# EAGLE design Qwiic Multi Distance Sensor - VL53L3CX (EAGLE 9.5.2)
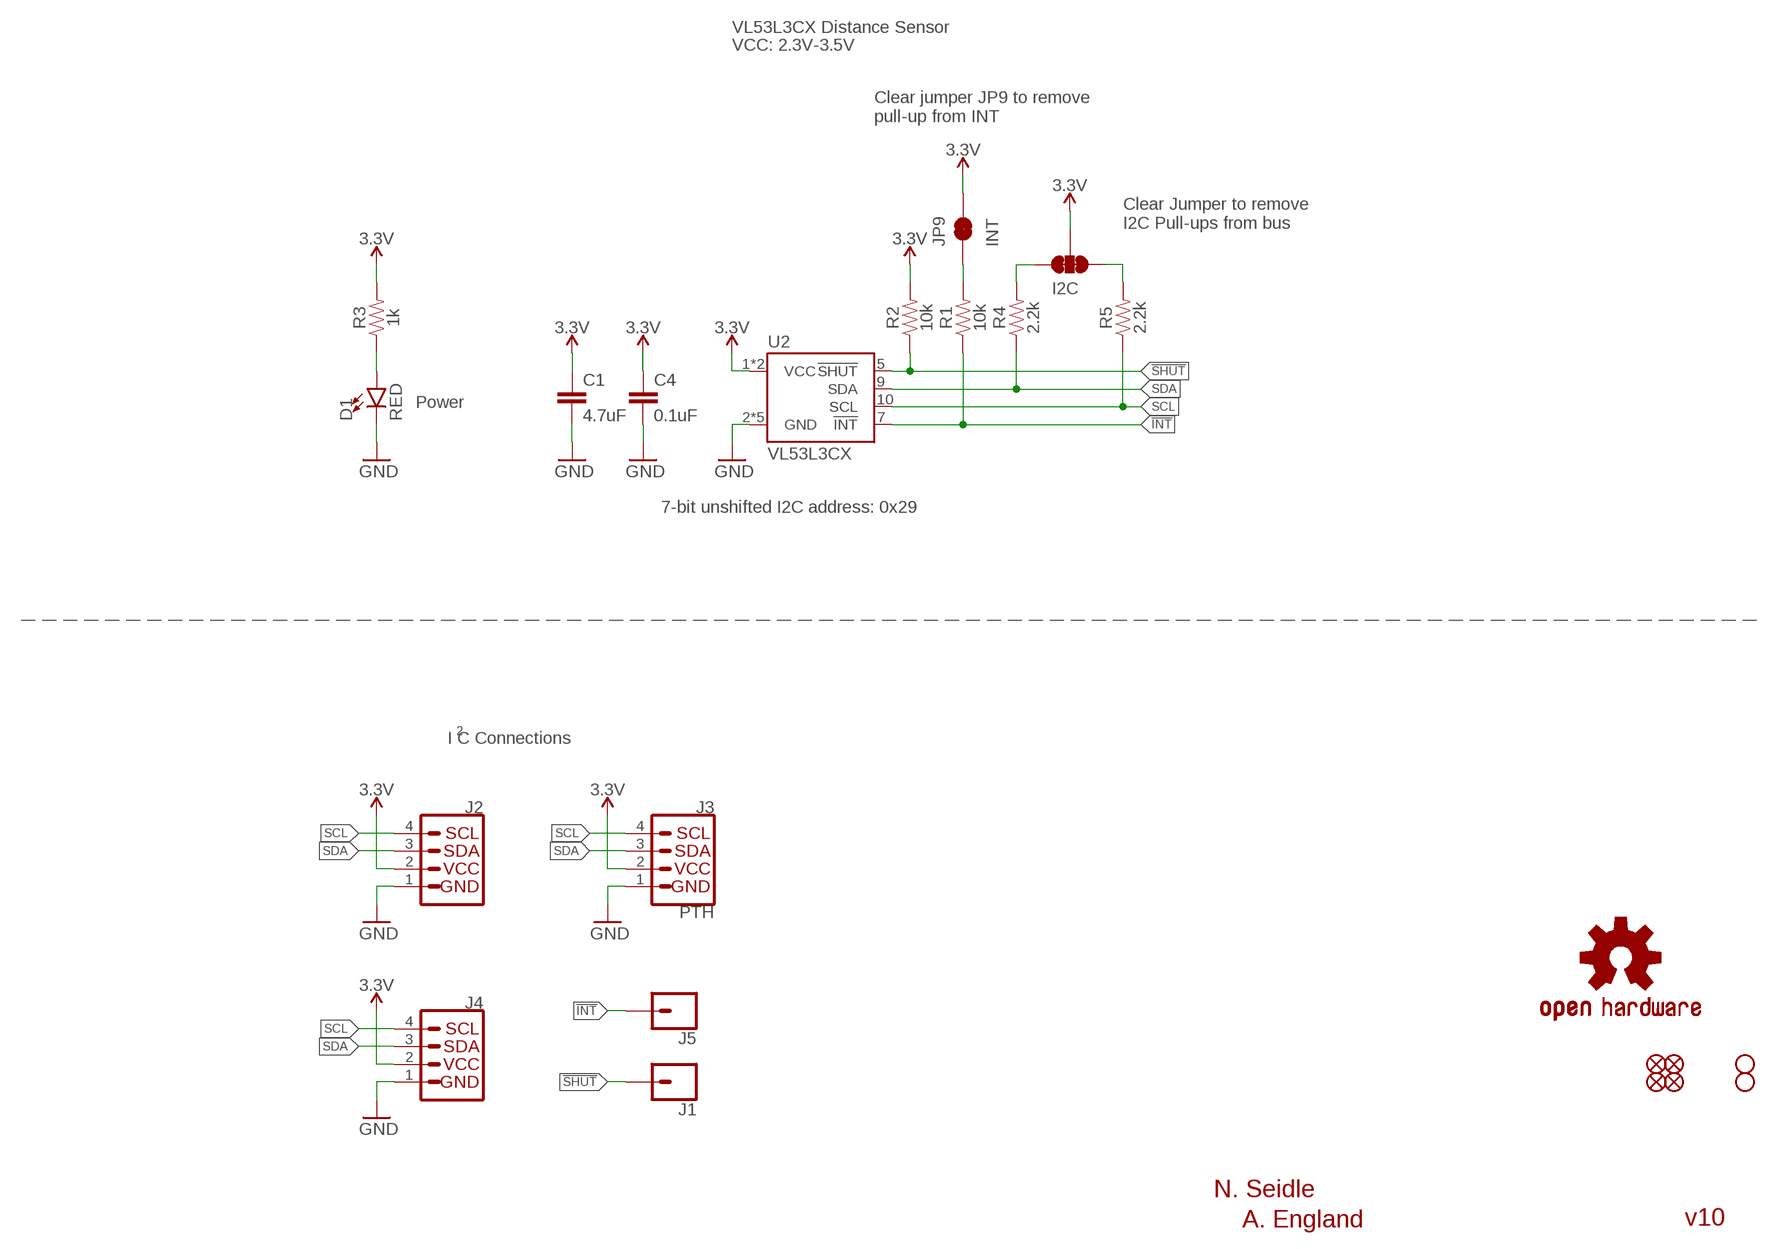
[diagram p0: schematic, sheet 1]

## Parts
C1  4.7uF  4.7UF0603  [0603]
C4  0.1uF  0.1UF-0603-25V-(+80/-20%)  [0603]
D1  RED  LED-RED0603  [LED-0603]
I2C  JUMPER-SMT_3_2-NC_TRACE_SILK  [SMT-JUMPER_3_2-NC_TRACE_SILK]
J1  CONN_01PTH_NO_SILK_YES_STOP  [1X01_NO_SILK]
J2  QWIIC_CONNECTORJS-1MM  [1X04_1MM_RA]
J3  PTH  I2C_STANDARD_NO_SILK  [1X04_NO_SILK]
J4  QWIIC_CONNECTORJS-1MM  [1X04_1MM_RA]
J5  CONN_01PTH_NO_SILK_YES_STOP  [1X01_NO_SILK]
JP1  FIDUCIALUFIDUCIAL  [MICRO-FIDUCIAL]
JP2  FIDUCIALUFIDUCIAL  [MICRO-FIDUCIAL]
JP3  STAND-OFF  [STAND-OFF]
JP4  STAND-OFF  [STAND-OFF]
JP5  FIDUCIALUFIDUCIAL  [MICRO-FIDUCIAL]
JP6  FIDUCIALUFIDUCIAL  [MICRO-FIDUCIAL]
JP9  INT  JUMPER-PAD-2-NC_BY_TRACE  [PAD-JUMPER-2-NC_BY_TRACE_YES_SILK]
LOGO1  OSHW-LOGOMINI  [OSHW-LOGO-MINI]
R1  10k  10KOHM-0603-1/10W-1%  [0603]
R2  10k  10KOHM-0603-1/10W-1%  [0603]
R3  1k  1KOHM-0603-1/10W-1%  [0603]
R4  2.2k  2.2KOHM-0603-1/10W-1%  [0603]
R5  2.2k  2.2KOHM-0603-1/10W-1%  [0603]
U2  VL53L3CX  VL53L1XSMD  [VL53L1X]

## Nets
3.3V: C1.1 C4.1 I2C.2 J2.2 J3.2(VCC) J4.2 JP9.2 R2.2 R3.2 U2.1(VCC) U2.11(VCC)
!INT: J5.1 R1.1 U2.7(!INT)
!SHUT: J1.1 R2.1 U2.5(!SHUT)
GND: C1.2 C4.2 D1.C J2.1 J3.1(GND) J4.1 U2.2(GND) U2.3(GND) U2.4(GND) U2.6(GND) U2.12(GND)
N$1: I2C.1 R5.2
N$2: I2C.3 R4.2
N$3: D1.A R3.1
N$4: JP9.1 R1.2
SCL: J2.4 J3.4(SCL) J4.4 R5.1 U2.10(SCL)
SDA: J2.3 J3.3(SDA) J4.3 R4.1 U2.9(SDA)

## Notes on the sheet
- VL53L3CX Distance Sensor
- VCC: 2.3V-3.5V
- Clear jumper JP9 to remove 
  pull-up from INT
- Clear Jumper to remove 
  I2C Pull-ups from bus
- Power
- 7-bit unshifted I2C address: 0x29
- 2
- I C Connections
- N. Seidle
- A. England | v10

## Library data of the parts
C1 = SparkFun-Capacitors:4.7UF: 4.7µF ceramic capacitors A capacitor is a passive two-terminal electrical component used to store electrical energy temporarily in an electric field.; PROD_ID: CAP-08280
C4 = SparkFun-Capacitors:0.1UF: 0.1µF ceramic capacitors A capacitor is a passive two-terminal electrical component used to store electrical energy temporarily in an electric field.; PROD_ID: CAP-00810
D1 = SparkFun-LED:LED-RED: Red SMD LED Used in manufacturing of most products at SparkFun Packages: 0603 - SMD 0603 package [Product Link] <http://docs.avagotech.com/docs/AV02-0551EN> 0603 SMART - SMD 0603 SMART package ( more efficient and expensive)[Product Link] <http://www.osram-os.com/Graphics/XPic2/00077099_0.pdf> 1206 - SMD1206 package [Product Link] <https://www.sparkfun.com/datasheets/DevTools/LilyPad/Q150OVS4.pdff> SparkFun Products: Pro Mini 328 -5V <https://www.sparkfun.com/products/821> RedBoard <https://www.sparkfun.com/products/12757> IOIO-OTG <https://www.sparkfun.com/products/13613>; PROD_ID: DIO-00819
I2C = SparkFun-Jumpers:JUMPER-SMT_3_2-NC_TRACE: Normally closed trace jumper (2 of 2 connections) This jumper has a trace between all three pads so they are normally closed (NC). Use a razor knife to open the connection(s). For best results follow the IPC guidelines for cutting traces: Cutout at least 0.063 mm (0.005 in). Remove all loose material to clean up the cut area. Seal the cut with an approved epoxy. Reapply solder to reclose the connection(s).
J1 J5 = SparkFun-Connectors:CONN_01: Single connection point. Often used as Generic Header-pin footprint for 0.1 inch spaced/style header connections On any of the 0.1 inch spaced packages, you can populate with these: Break Away Headers - Straight <https://www.sparkfun.com/products/116> (PRT-00116) Break Away Male Headers - Right Angle <https://www.sparkfun.com/products/553> (PRT-00553) Female Headers <https://www.sparkfun.com/products/115> (PRT-00115) Break Away Headers - Machine Pin <https://www.sparkfun.com/products/117> (PRT-00117) Break Away Female Headers - Swiss Machine Pin <https://www.sparkfun.com/products/743> (PRT-00743) This device is also useful as a general connection point to wire up your design to another part of your project. Our various solder wires solder well into these plated through hole pads. Hook-Up Wire - Assortment (Stranded, 22 AWG) <https://www.sparkfun.com/products/11375> (PRT-11375) Hook-Up Wire - Assortment (Solid Core, 22 AWG) <https://www.sparkfun.com/products/11367> (PRT-11367) View the entire wire category on our website here <https://www.sparkfun.com/categories/141> Special notes: SMTSO-256-ET is a "flush mount" nut for a 4-40 screw. We mostly use this on specialty testbeds; it is a nice way to connect hardware to your PCB at an adjustable hieght. Also note, the SNAP packages are for using a snappable style connector. We sell a baggie of snaps and they are also used on two LilyPad designs: Snap Assortment - 30 pack (male and female) <https://www.sparkfun.com/products/11347> (DEV-11347) LilyPad Arduino SimpleSnap <https://www.sparkfun.com/products/10941> (DEV-10941) LilyPad SimpleSnap Protoboard <https://www.sparkfun.com/products/10940> (DEV-10940)
J2 J4 = SparkFun-Connectors:QWIIC_CONNECTOR: SparkFun I2C Standard Qwiic Connector An SMD 1mm pitch JST connector makes it easy and quick (get it? Qwiic?) to connect I2C devices to each other. The Qwiic system <http://www.sparkfun.com/qwiic> enables fast and solderless connection between popular platforms and various sensors and actuators. We carry 200mm <https://www.sparkfun.com/products/14204>, 100mm <https://www.sparkfun.com/products/14205>, 50mm <https://www.sparkfun.com/products/14206>, and breadboard friendly <https://www.sparkfun.com/products/14207> Qwiic cables. We also offer 10 pcs strips <https://www.sparkfun.com/products/14323> the SMD connectors.; PROD_ID: CONN-13694
J3 = SparkX:I2C_STANDARD: SparkFun I2C Standard Pinout Header SparkFun has standardized on a pinout for all I2C based sensor breakouts. This pinout allows I2C boards to be plugged directly into the headers on Arduino Uno compatible boards, and to be daisy chained easily. Example SparkFun Products: SparkFun Atmospheric Sensor Breakout - BME280 <https://www.sparkfun.com/products/13676> SparkFun Altitude/Pressure Sensor Breakout - MPL3115A2 <https://www.sparkfun.com/products/11084> SparkFun TOF Range Finder Sensor - VL6180 <https://www.sparkfun.com/products/12785>
JP1 JP2 JP5 JP6 = SparkFun:FIDUCIAL: Fiducial Alignment Points Various fiducial points for machine vision alignment.
JP3 JP4 = SparkFun:STAND-OFF: Stand Off This is the mechanical footprint for a #4 phillips button head screw. Use the keepout ring to avoid running the screw head into surrounding components. SKU : PRT-00447
JP9 = SparkFun-Passives:JUMPER-PAD-2-NC_BY_TRACE
LOGO1 = SparkFun-Aesthetics:OSHW-LOGO: Open-Source Hardware (OSHW) Logo This logo indicates the piece of hardware it is found on incorporates a OSHW license and/or adheres to the definition of open source hardware found here: http://freedomdefined.org/OSHW
R1 R2 = SparkFun-Resistors:10KOHM: 10kΩ resistor A resistor is a passive two-terminal electrical component that implements electrical resistance as a circuit element. Resistors act to reduce current flow, and, at the same time, act to lower voltage levels within circuits. - Wikipedia; PROD_ID: RES-00824
R3 = SparkFun-Resistors:1KOHM: 1kΩ resistor A resistor is a passive two-terminal electrical component that implements electrical resistance as a circuit element. Resistors act to reduce current flow, and, at the same time, act to lower voltage levels within circuits. - Wikipedia; PROD_ID: RES-07856
R4 R5 = SparkFun-Resistors:2.2KOHM: 2.2kΩ resistor A resistor is a passive two-terminal electrical component that implements electrical resistance as a circuit element. Resistors act to reduce current flow, and, at the same time, act to lower voltage levels within circuits. - Wikipedia; PROD_ID: RES-08272
U2 = SparkFun-Sensors:VL53L1X: STMicroelectronics VL53L1X - 400 cm IR Laser ToF Sensor VL53L1X is a state-of-the-art ToF laser-ranging sensor, enhancing the ST FlightSense product family. It is the fastest miniature ToF sensor currently on the market with accurate ranging up to 4 m and fast ranging frequency (up to 50 Hz). Housed in a miniature and reflowable package, it integrates a single photon avalanche diode (SPAD) receiving array, a 940 nm invisible laser Class 1 emitter, physical infrared filters, and optics to achieve the best ranging performance in various ambient lighting conditions with a range of cover window options.; PROD_ID: IC-13960

## Net classes
1 power: width 0.203 mm

## Board
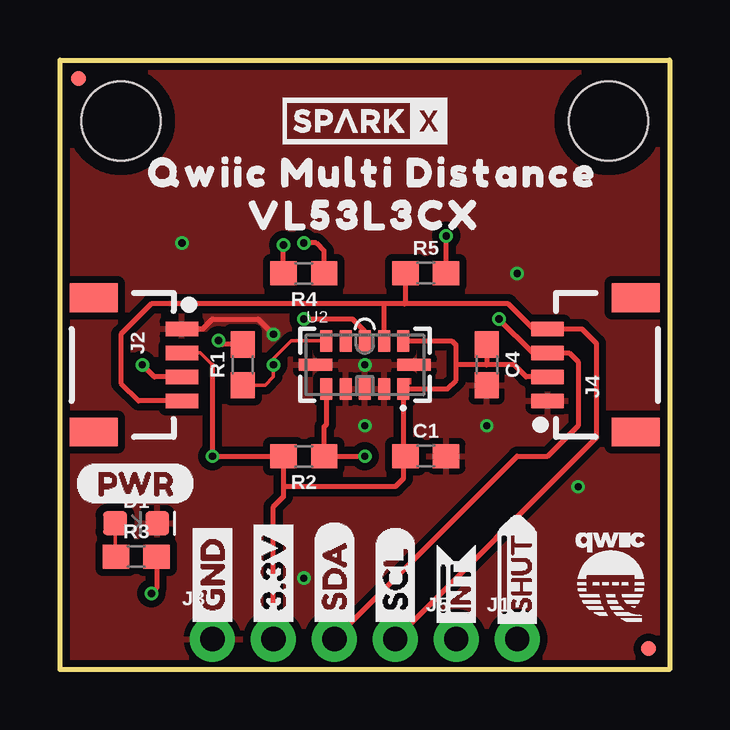
[diagram p1: board, top side]
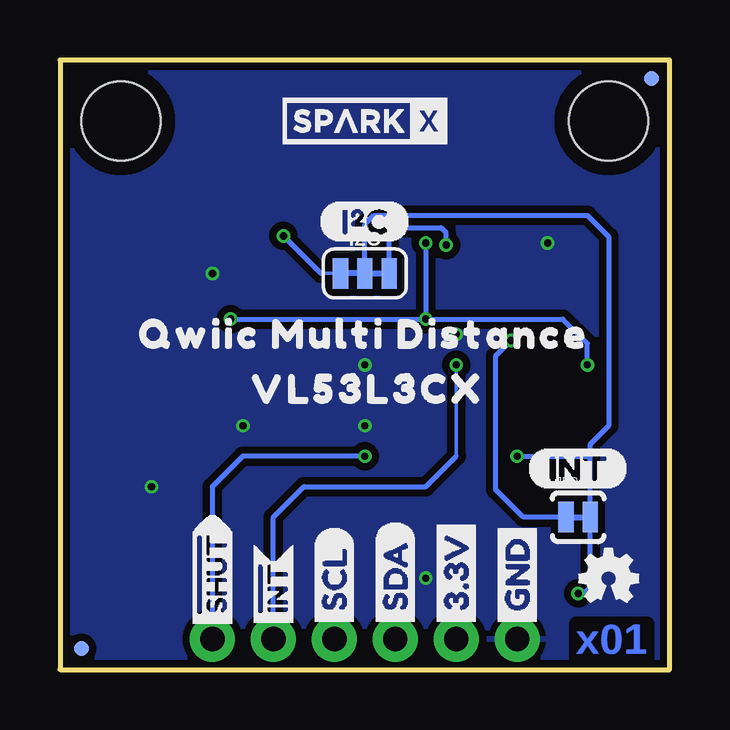
[diagram p2: board, bottom side, seen from below]

Size 25.4 x 25.4 mm. Coordinates in mm from the lower left corner, seen from the top.
Outline: 0,0 0,25.4 25.4,25.4 25.4,0 0,0
Copper layers (1*16): Top 0.035mm / dielectric 1.5mm / Bottom 0.035mm
Design rules "SparkFun-2-layer-FAB-LIMIT": minimum track width 4mil, minimum drill 6mil, track to track 4mil, track to pad 4mil, pad to pad 4mil, via to via 4mil, smd to smd 4mil, copper to edge 4mil, drill to drill 4mil, minimum pad ring 5mil, minimum via ring 5mil, stop-mask expansion 4mil, vias tented up to drill 25mil, thermal gap 10mil

### Footprints (pad centres in the part's own frame; a part is rotated, then mirrored left to right if it is on the bottom)
0603 = smd 1.1 x 1: 1 -0.85,0; 2 0.85,0
LED-0603 = smd 1 x 1: A -0.877,0; C 0.877,0
SMT-JUMPER_3_2-NC_TRACE_SILK = smd 0.635 x 1.27: 1 -1.016,0; 2 0,0; 3 1.016,0
1X01_NO_SILK = drill 1.016 pad 1.88: 1 0,0
1X04_1MM_RA = smd 0.6 x 1.35: 1 -1.5,0; 2 -0.5,0; 3 0.5,0; 4 1.5,0 | smd 1.2 x 2: NC1 2.8,-3.675; NC2 -2.8,-3.675
1X04_NO_SILK = drill 1.016 pad 1.88: 1 0,0; 2 2.54,0; 3 5.08,0; 4 7.62,0
MICRO-FIDUCIAL = smd 0.635 x 0.635: 1 0,0
STAND-OFF = hole 3.302: 0,0
PAD-JUMPER-2-NC_BY_TRACE_YES_SILK = smd 0.635 x 1.27: 1 -0.508,0; 2 0.508,0
VL53L1X = smd 0.5 x 0.9: 1 1.6,-1; 2 0.8,-1; 3 0,-1; 4 -0.8,-1; 5 -1.6,-1; 7 -1.6,1; 8 -0.8,1; 9 0,1; 10 0.8,1; 11 1.6,1 | smd 1.4 x 0.5: 6 -2.05,0; 12 2.05,0

### Placement (x,y rotation side)
C1  15.24,8.89 0 top
C4  17.78,12.7 270 top
D1  3.17,6.1 0 top
I2C  12.7,16.51 0 bottom
J1  19.05,1.27 0 top
J2  5.08,12.7 270 top
J3  6.35,1.27 0 top
J4  20.32,12.7 90 top
J5  16.51,1.27 0 top
JP1  0.76,24.64 0 bottom
JP2  24.51,0.89 0 top
JP3  2.54,22.86 0 top
JP4  22.86,22.86 0 top
JP5  24.51,0.89 0 bottom
JP6  0.76,24.64 0 top
JP9  3.81,6.35 0 bottom
LOGO1  2.54,3.81 0 bottom
R1  7.62,12.7 90 top
R2  10.16,8.89 180 top
R3  3.17,4.7 0 top
R4  10.16,16.51 180 top
R5  15.24,16.51 0 top
U2  12.7,12.7 0 top
U$1  [VL53L3CX0]  6.99,18.92 0 top
U$2  [QWIIC_MULTI_DISTANCE1]  2.79,20.7 0 top
U$3  [GND1]  6.35,1.52 90 bottom
U$4  [3#3V2]  8.89,1.52 90 bottom
U$5  [SDA8]  11.43,1.52 90 bottom
U$6  [SCL9]  13.97,1.52 90 bottom
U$7  [INT#-[<]  16.51,1.27 90 top
U$8  [#SHUT15]  19.05,1.27 90 top
U$9  [#SHUT15]  19.05,1.27 90 bottom
U$10  [(PWR)]  0.64,7.75 0 top
U$11  [(I_SUPER2_C)]  14.61,18.67 0 bottom
U$12  [(INT)]  5.97,8.38 0 bottom
U$13  [QWIIC-LOGO-SMALL]  22.86,3.81 0 top
U$14  [INT#-[<]  16.51,1.27 90 bottom
U$15  [QWIIC_MULTI_DISTANCE1]  22.99,13.97 0 bottom
U$16  [VL53L3CX0]  18.29,11.68 0 bottom
U$17  [SPARKX-SMALL]  12.7,22.86 0 top
U$18  [SPARKX-SMALL]  12.7,22.86 0 bottom
U$21  [3#3V2]  8.89,1.52 90 top
U$22  [GND1]  6.35,1.52 90 top
U$26  [SCL9]  13.97,1.52 90 top
U$27  [SDA8]  11.43,1.52 90 top

### Tracks (layer width: path | path; a pad name or v marks a point on that pad's centre or on a via)
3.3V  (via drill 0.3)
  Top 0.152: 14.3,8.98 C1.1 | J2.2 5.85,13.2 6.35,12.7 | C4.1 17.74,13.51 17.78,13.47
  Top 0.203: J4.2 19.42,12.2 18.92,12.7 17.78,12.7 | J3.2 8.89,6.78 9.31,7.2 9.31,7.62 | 6.35,12.7 v6.35,8.89 R2.2 9.31,7.62 | 9.31,7.62 13.97,7.62 14.3,7.95 14.3,8.98 U2.1 16.14,11.7 16.51,12.06 16.51,12.7 | 16.51,12.7 16.51,13.51 16.32,13.7 U2.11 | R3.2 4.03,3.39 v3.81,3.17 | 17.78,12.7 16.51,12.7 | 17.78,13.47 17.78,12.7
  Bottom 0.203: v6.35,8.89 3.3,8.89 | 3.3,8.89 JP9.2 3.3,3.43 3.56,3.17 v3.81,3.17 | 3.3,8.89 3.3,9.4 2.54,10.16 2.54,18.03 3.43,18.92 12.32,18.92 12.7,18.54 I2C.2
!INT  (via drill 0.3)
  Top 0.152: U2.7 9.64,13.7 8.89,12.95 v8.89,12.7 8.89,12.19 8.55,11.85 R1.1
  Bottom 0.152: 8.89,8.89 v8.89,12.7
  Bottom 0.203: J5.1 16.51,6.35 15.24,7.62 10.16,7.62 8.89,8.89
!SHUT  (via drill 0.3)
  Top 0.203: U2.5 11.1,10.21 11.01,10.12 R2.1 v12.7,8.89
  Bottom 0.203: v12.7,8.89 17.78,8.89 19.05,7.62 J1.1
GND  (via drill 0.3)
  Top 0.203: J2.1 5.95,14.2 6.35,14.61 8.26,14.61 v8.89,13.97
  other vias: 12.7,12.7 17.78,10.16 10.16,3.81 19.05,16.51 12.7,10.16 21.59,7.62 5.08,17.78
  pour Bottom (isolate 0.305): 0,0 0,25.4 25.4,25.4 25.4,0
  pour Top (isolate 0.305): 0,0 0,25.4 25.4,25.4 25.4,0
N$1  (via drill 0.3)
  Top 0.203: R5.2 v16.09,18.07
  Bottom 0.152: I2C.1 14.53,16.51
  Bottom 0.203: 14.53,16.51 v16.09,18.07
N$2  (via drill 0.3)
  Top 0.203: R4.2 v9.31,17.69
  Bottom 0.203: I2C.3 11.68,18.16 11.43,18.41 9.53,18.41 9.31,18.2 v9.31,17.69
N$3
  Top 0.152: D1.A 2.3,4.73 R3.1
N$4  (via drill 0.3)
  Top 0.203: R1.2 6.77,13.55 v6.6,13.72
  Bottom 0.152: 6.86,13.46 v6.6,13.72
  Bottom 0.203: v6.6,13.72 7.24,13.08 7.24,7.49 6.1,6.35 JP9.1
SCL
  Top 0.152: J4.4 19.71,14.2 | 13.5,15.2 13.46,15.24 | 14.39,15.28 14.35,15.24
  Top 0.203: 19.71,14.2 18.67,15.24 14.35,15.24 13.46,15.24 3.81,15.24 2.54,13.97 2.54,11.94 3.28,11.2 J2.4 | J4.4 21.74,14.2 22.35,13.59 22.35,9.65 J3.4 | U2.10 13.5,15.2 | R5.1 14.39,15.28
SDA  (via drill 0.3)
  Top 0.152: U2.9 12.7,14.1
  Top 0.203: v18.29,14.61 19.69,13.2 J4.3 21.22,13.2 21.59,12.83 21.59,10.16 20.32,8.89 19.05,8.89 J3.3 | J2.3 3.93,12.2 v3.43,12.7 | R4.1 11.01,17.44 10.67,17.78 v10.16,17.78 | 12.7,14.1 12.19,14.61 v10.16,14.61
  Bottom 0.203: v3.43,12.7 3.43,13.59 4.45,14.61 v10.16,14.61 | v18.29,14.61 v10.16,14.61 | v10.16,17.78 v10.16,14.61

### Text on the board
Bottom: x01